# Altium schematic sheet ControlCommande&Motors.SchDoc
size A3; Organization: Altium Limited; Address1: Laboratoire de Systèmes Embarqués; Address2: 7, rue de la Serre; Address3: 2610 Saint-Imier / Switzerland; PageSetup: Record=PageOptions|CenterHorizontal=True|CenterVertical=True|PrintScale=0.24|XCorrection=1.00|YCorrection=1.00|PrintKind=0|BorderSize=5000000|LeftOffset=0|BottomOffset=0|Orientation=2|PaperLength=1000|PaperWidth=1000|Scale=100|PaperSource=7|PrintQuality=-4|MediaType=1|DitherType=10|PaperKind=A4|PrintScaleMode=1
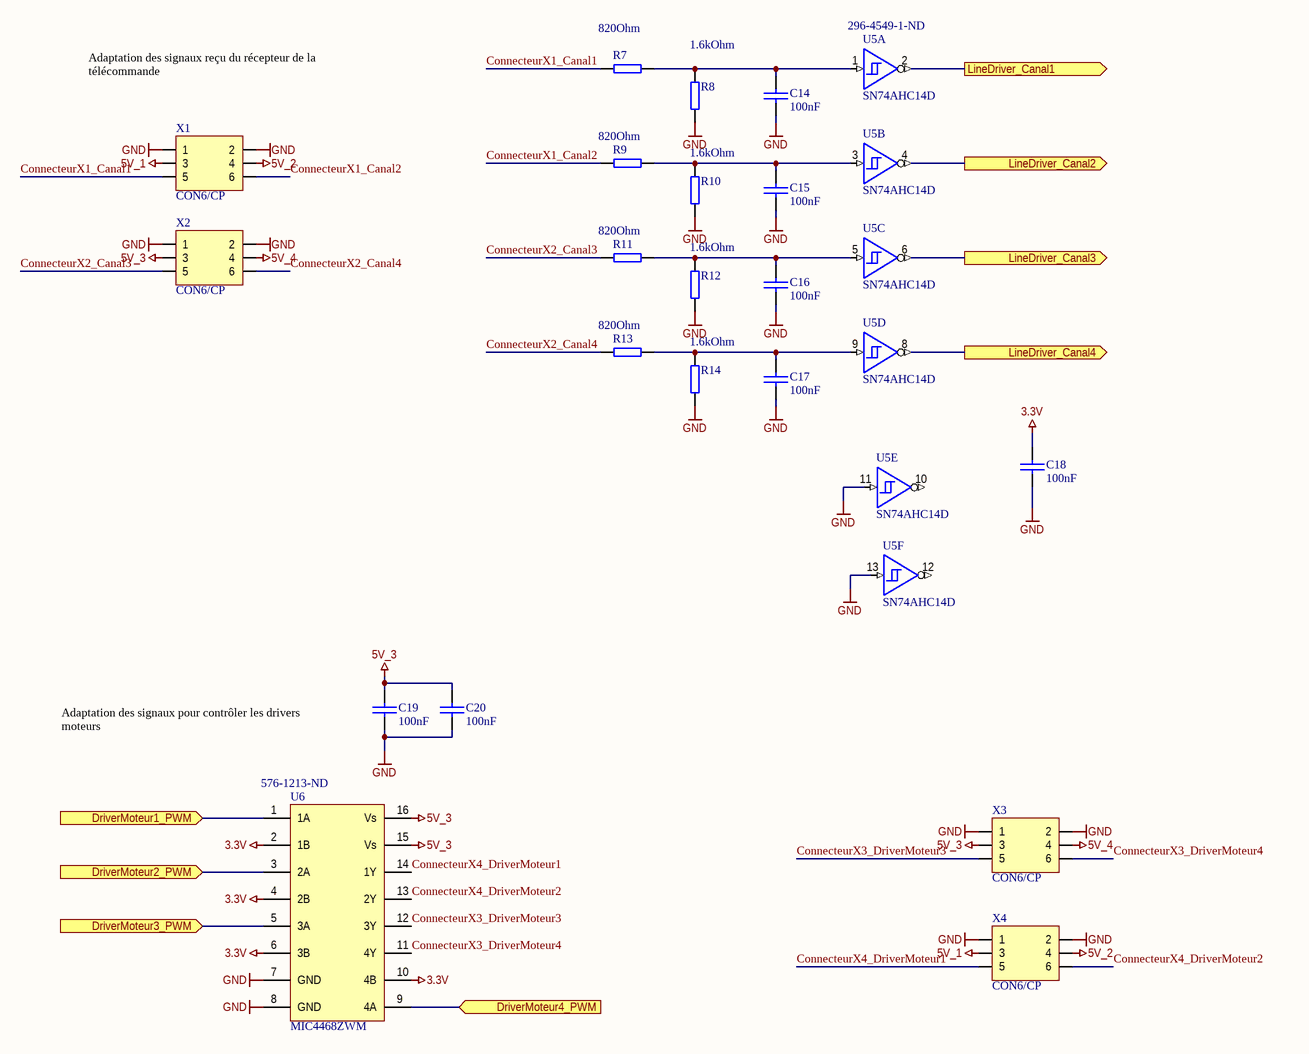
[diagram p0: ControlCommande&Motors.SchDoc]

## Parts
C14  value 100nF  [060301]  (hidden comment: GRM188R71E104KA01D)
C15  value 100nF  [060301]  (hidden comment: GRM188R71E104KA01D)
C16  value 100nF  [060301]  (hidden comment: GRM188R71E104KA01D)
C17  value 100nF  [060301]  (hidden comment: GRM188R71E104KA01D)
C18  value 100nF  [060301]  (hidden comment: GRM188R71E104KA01D)
C19  value 100nF  [060301]  (hidden comment: GRM188R71E104KA01D)
C20  value 100nF  [060301]  (hidden comment: GRM188R71E104KA01D)
R7  value 820Ohm  [080501]  (hidden comment: RMCF0805JT820R)
R8  value 1.6kOhm  [080501]  (hidden comment: ERJ-6GEYJ162V)
R9  value 820Ohm  [080501]  (hidden comment: RMCF0805JT820R)
R10  value 1.6kOhm  [080501]  (hidden comment: ERJ-6GEYJ162V)
R11  value 820Ohm  [080501]  (hidden comment: RMCF0805JT820R)
R12  value 1.6kOhm  [080501]  (hidden comment: ERJ-6GEYJ162V)
R13  value 820Ohm  [080501]  (hidden comment: RMCF0805JT820R)
R14  value 1.6kOhm  [080501]  (hidden comment: ERJ-6GEYJ162V)
U5  SN74AHC14D  Supplier Part Number 1: 296-4549-1-ND  [SO1401]  (parts A,B,C,D,E,F of 6)
U6  MIC4468ZWM  Supplier Part Number 1: 576-1213-ND  [SOIC127P1030-16M]
X1  CON6/CP  [J2X3_2.54]
X2  CON6/CP  [J2X3_2.54]
X3  CON6/CP  [J2X3_2.54]
X4  CON6/CP  [J2X3_2.54]

## Ports
DriverMoteur1_PWM (in), DriverMoteur2_PWM (in), DriverMoteur3_PWM (in), DriverMoteur4_PWM (in), LineDriver_Canal1 (out), LineDriver_Canal2 (out), LineDriver_Canal3 (out), LineDriver_Canal4 (out)

## Nets
3.3V: C18.1 U5.14(3.3V) U6.2(1B) U6.4(2B) U6.6(3B) U6.10(4B)
5V_1: X1.3 X4.3
5V_2: X1.4 X4.4
5V_3: C19.1 C20.1 U6.15(Vs) U6.16(Vs) X2.3 X3.3
5V_4: X2.4 X3.4
GND: C14.2 C15.2 C16.2 C17.2 C18.2 C19.2 C20.2 R8.2 R10.2 R12.2 R14.2 U5.7(GND) U5.11 U5.13 U6.7(GND) U6.8(GND) X1.1 X1.2 X2.1 X2.2 X3.1 X3.2 X4.1 X4.2
ConnecteurX1_Canal1: R7.1 X1.5
ConnecteurX1_Canal2: R9.1 X1.6
ConnecteurX2_Canal3: R11.1 X2.5
ConnecteurX2_Canal4: R13.1 X2.6
ConnecteurX3_DriverMoteur3: U6.12(3Y) X3.5
ConnecteurX3_DriverMoteur4: U6.11(4Y) X3.6
ConnecteurX4_DriverMoteur1: U6.14(1Y) X4.5
ConnecteurX4_DriverMoteur2: U6.13(2Y) X4.6
DriverMoteur1_PWM: U6.1(1A) ; port DriverMoteur1_PWM
DriverMoteur2_PWM: U6.3(2A) ; port DriverMoteur2_PWM
DriverMoteur3_PWM: U6.5(3A) ; port DriverMoteur3_PWM
DriverMoteur4_PWM: U6.9(4A) ; port DriverMoteur4_PWM
LineDriver_Canal1: U5.2 ; port LineDriver_Canal1
LineDriver_Canal2: U5.4 ; port LineDriver_Canal2
LineDriver_Canal3: U5.6 ; port LineDriver_Canal3
LineDriver_Canal4: U5.8 ; port LineDriver_Canal4
NetC14_1: C14.1 R7.2 R8.1 U5.1
NetC15_1: C15.1 R9.2 R10.1 U5.3
NetC16_1: C16.1 R11.2 R12.1 U5.5
NetC17_1: C17.1 R13.2 R14.1 U5.9

Not connected (* = marked no-connect by the designer): U5 10 12

## Notes on the sheet
- (near X1) Adaptation des signaux reçu du récepteur de la télécommande
- Adaptation des signaux pour contrôler les drivers moteurs
- Title
- Size:
- Date:
- A3
- Author:
- Time:
- Revision:
- Sheet
- of
- File:

## Library data of the parts
C14-C20 = CAPA: EtatCommande: Interne; Text Field1: CAPA; Supplier 1: Digi-Key; Supplier Part Number 1: 490-1524-1-ND
R7-R14 = RES: Text Field1: RESISTANCE; EtatCommande: Interne; Supplier 1: Digi-Key
  R7 R9 R11 R13: Supplier Part Number 1: RMCF0805JT820RDKR-ND
  R8 R10 R12 R14: Supplier Part Number 1: P1.6KACT-ND
U5 = SN74AHC14D: EtatCommande: Commandé; Supplier 1: Digi-Key
U6 = MIC4468: EtatCommande: Commandé; Supplier 1: Digi-Key
X1 = CON6/CP: Connecteur récepteur télécommande cannaux 1 & 2; EtatCommande: Interne
X2 = CON6/CP: Connecteur récepteur télécommande cannaux 3 & 4; EtatCommande: Interne
X3 = CON6/CP: Connecteur contrôleur moteurs 3 (arrière) & 4 (gauche); EtatCommande: Interne
X4 = CON6/CP: Connecteur contrôleur moteurs 1 (avant) & 2 (droite); EtatCommande: Interne